# EAGLE schematic Light switch schematic (EAGLE 9.1.3)
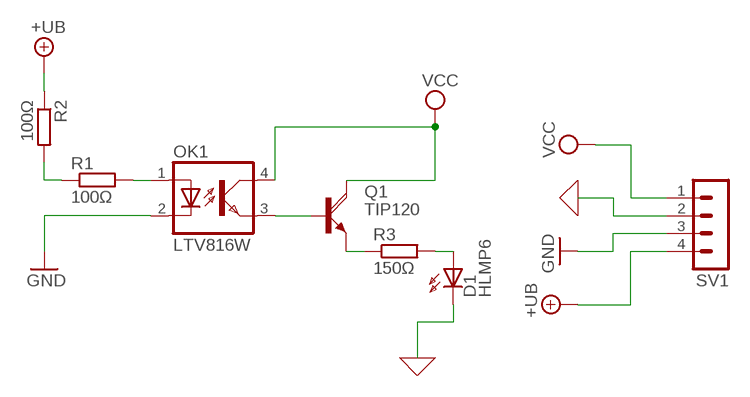
[diagram p0: schematic, sheet 1]

## Parts
D1  HLMP6  [HLMP6]
OK1  LTV816W  [DIL4-SMD]
Q1  TIP120  [TO220AH]
R1  100Ω  R-EU_0207/10  [0207/10]
R2  100Ω  R-EU_0207/10  [0207/10]
R3  150Ω  R-EU_0207/10  [0207/10]
SV1  MA04-1  [MA04-1]

## Nets
0: D1.K SV1.2 ; supply symbol labelled GND
+UB: R2.1 SV1.4
GND: OK1.2(C) SV1.3
N$1: OK1.3(EMIT) Q1.B
N$2: OK1.1(A) R1.2
N$3: R1.1 R2.2
N$4: Q1.E R3.1
N$5: D1.A R3.2
VCC: OK1.4(COL) Q1.C SV1.1

## Library data of the parts
D1 = display-hp:HLMP6: LED 2mm horizontal; MF: AGILENT TECHNOLOGIES; MPN: HLMP-6500; OC_FARNELL: 1652490; OC_NEWARK: 40K0088
OK1 = PC357:LTV816: OPTO COUPLER Source: LITEON, LTV816.pdf
Q1 = Powaaah-transistor:TIP120: NPN DARLINGTON TRANSISTOR
R1 R2 = resistor:R-EU_: RESISTOR, European symbol
R3 = resistor:R-EU_: RESISTOR, European symbol; SPICEPREFIX: R
SV1 = con-lstb:MA04-1: PIN HEADER; OC_FARNELL: unknown; OC_NEWARK: unknown

## Net classes
0 default: width 1.016 mm, drill 1.016 mm, clearance 1.016 mm